# Altium project Rear_Controller.PrjPcb (part 2 of 2)
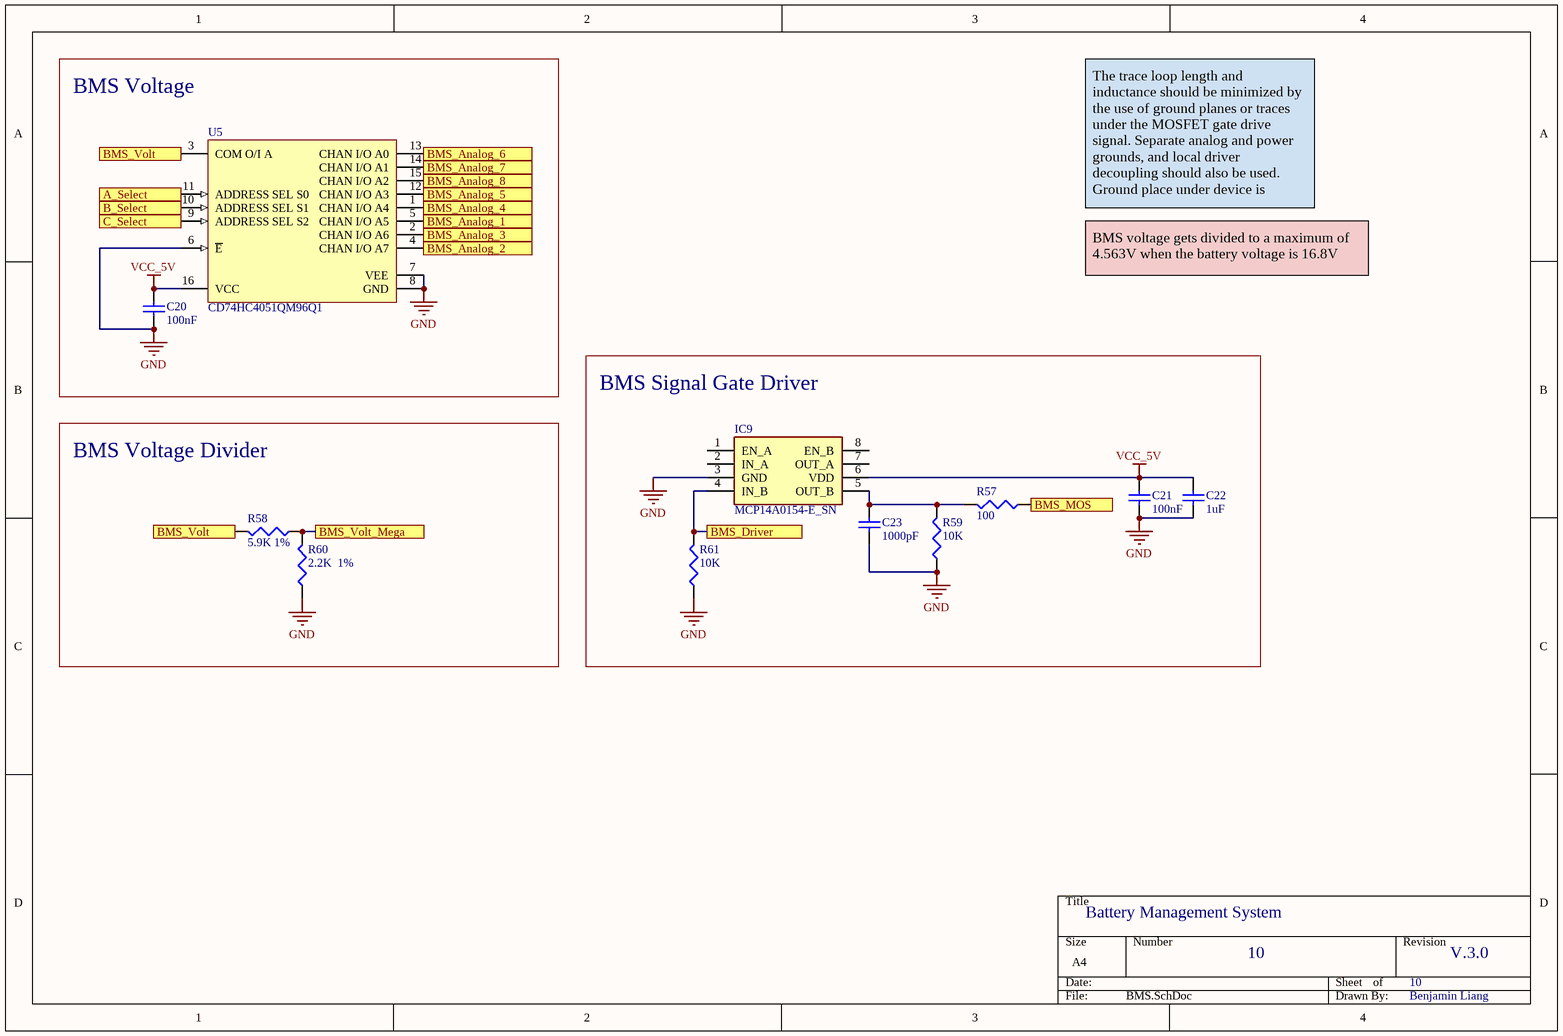
[diagram p11: BMS.SchDoc]

## Nets that join several sheets
Board_GND: Arduino_Shields (U1.31), Passive_Circuits (8 pins), Frequency_Analog (24 pins), SPI_Breakout (5 pins), Connector (12 pins), PWM_Pump_Led (8 pins), Power_Relay (8 pins), Shutdown_Circuit (6 pins), Power_Distribution (R54.1)
GND: Arduino_Shields (A1.GND1 A1.GND2 A1.GND4 A1.GND5), Passive_Circuits (R27.2 R30.2), Connector (J1.5), Power_Relay (R38.2 R64.2), Power_Distribution (10 pins), BMS (11 pins)
INV_AGND: Arduino_Shields (U1.6), Passive_Circuits (C3.2 C4.2), SPI_Breakout (J5.10), Connector (X1.3 X1.6 X2.31)
VCC_3.3V: Arduino_Shields (A1.3V3 U1.19), Frequency_Analog (IC5.11 IC6.11 IC7.11 IC8.11), SPI_Breakout (J4.1 J7.1)
VCC_5V: Passive_Circuits (6 pins), Frequency_Analog (12 pins), SPI_Breakout (6 pins), Connector (10 pins), Shutdown_Circuit (6 pins), Power_Distribution (F8.3 F8.4 R53.2), BMS (5 pins)
VCC_8V: Arduino_Shields (A1.VIN U1.32), Power_Distribution (F9.3 F9.4)
VCC_12V: Power_Relay (13 pins), Power_Distribution (F5.3 F5.4)
A_Select: Arduino_Shields (A1.35), BMS (U5.11)
APPS_2_4.5V: Connector (X1.34), Power_Distribution (R53.1 R54.2)
APPS_In_1_Analog: Arduino_Shields (U1.21), Passive_Circuits (C4.1 R17.1)
APPS_In_1_Analog_H: Passive_Circuits (R17.2), Connector (X1.30)
APPS_In_2_Analog: Arduino_Shields (U1.22), Passive_Circuits (C3.1 R13.1)
APPS_In_2_Analog_H: Passive_Circuits (R13.2), Connector (X1.29)
APPS_Out_Analog: Arduino_Shields (U1.26), SPI_Breakout (J5.6), Connector (X2.27)
B_Select: Arduino_Shields (A1.34), BMS (U5.10)
BATT_14.8V: Connector (J2.1 J2.2 J2.3), Power_Distribution (13 pins)
BMS_Analog_1: Connector (P1.2), BMS (U5.5)
BMS_Analog_2: Connector (P1.3), BMS (U5.4)
BMS_Analog_3: Connector (P1.4), BMS (U5.2)
BMS_Analog_4: Connector (P1.5), BMS (U5.1)
BMS_Analog_5: Connector (P2.2), BMS (U5.12)
BMS_Analog_6: Connector (P2.3), BMS (U5.13)
BMS_Analog_7: Connector (P2.4), BMS (U5.14)
BMS_Analog_8: Connector (P2.5), BMS (U5.15)
BMS_Driver: Arduino_Shields (A1.7), BMS (IC9.4 R61.2)
BMS_MOS: Connector (J1.6), BMS (R57.1)
BMS_Temp_Analog_1: Arduino_Shields (A1.AD0), Passive_Circuits (R27.1), Connector (J1.3)
BMS_Temp_Analog_2: Arduino_Shields (A1.AD1), Passive_Circuits (R30.1), Connector (J1.4)
BMS_Volt_Mega: Arduino_Shields (A1.AD12), BMS (R58.1 R60.2)
Brake_Digital: Arduino_Shields (A1.29), Connector (X2.29)
Brake_In_Analog: Arduino_Shields (U1.23), Passive_Circuits (C5.1 R21.1)
Brake_In_Analog_H: Passive_Circuits (R21.2), Connector (X1.28)
C_Select: Arduino_Shields (A1.36), BMS (U5.9)
CAN_1_INT: Arduino_Shields (A1.3), SPI_Breakout (J3.17)
CAN_2_INT: Arduino_Shields (A1.2), SPI_Breakout (J6.17)
CAN_3_INT: Arduino_Shields (U1.7), SPI_Breakout (J8.17)
CANH: SPI_Breakout (J3.2 J8.2), Connector (X2.34 X3.32)
CANL: SPI_Breakout (J3.3 J8.3), Connector (X2.35 X3.33)
Cool_PSR_INV_IN_ANALOG: Arduino_Shields (A1.AD6), Connector (X2.19)
Cool_PSR_INV_OUT_ANALOG: Arduino_Shields (A1.AD7), Connector (X2.8)
Cool_PSR_MTR_IN_ANALOG: Arduino_Shields (A1.AD10), Connector (X2.21)
Cool_PSR_MTR_OUT_ANALOG: Arduino_Shields (A1.AD11), Connector (X2.10)
Cool_Temp_INV_IN_ANALOG: Arduino_Shields (A1.AD4), Passive_Circuits (R14.1), Connector (X2.18)
Cool_Temp_INV_OUT_ANALOG: Arduino_Shields (A1.AD5), Passive_Circuits (R18.1), Connector (X2.7)
Cool_Temp_MTR_IN_ANALOG: Arduino_Shields (A1.AD8), Passive_Circuits (R23.1), Connector (X2.20)
Cool_Temp_MTR_OUT_ANALOG: Arduino_Shields (A1.AD9), Passive_Circuits (R25.1), Connector (X2.9)
CS_ACCEL: Arduino_Shields (A1.49), SPI_Breakout (J4.13)
CS_APPS: Arduino_Shields (U1.12), SPI_Breakout (J5.13)
CS_CAN_1: Arduino_Shields (A1.47), SPI_Breakout (J3.13)
CS_CAN_2: Arduino_Shields (A1.48), SPI_Breakout (J6.13)
CS_CAN_3: Arduino_Shields (U1.14), SPI_Breakout (J8.13)
CS_GYRO: Arduino_Shields (A1.53), SPI_Breakout (J7.13)
DAQ_12V: Connector (8 pins), Power_Distribution (F7.3 F7.4)
DAQ_CANH: SPI_Breakout (J6.2), Connector (6 pins)
DAQ_CANL: SPI_Breakout (J6.3), Connector (6 pins)
Dash_Switch_1_Digital: Arduino_Shields (A1.23), Passive_Circuits (R20.1), Connector (X3.17)
Dash_Switch_2_Digital: Arduino_Shields (A1.22), Passive_Circuits (R15.1), Connector (X3.28)
FAN_L_14.8V: Power_Relay (K3.1), Power_Distribution (F4.3 F4.4)
FAN_L_14.8V_H: Connector (X3.10), Power_Relay (K3.4)
FAN_L_Digital: Arduino_Shields (A1.31), Power_Relay (R34.1 R36.1)
FAN_R_14.8V: Power_Relay (K1.1), Power_Distribution (F3.3 F3.4)
FAN_R_14.8V_H: Connector (X1.35), Power_Relay (K1.4)
FAN_R_Digital: Arduino_Shields (A1.33), Power_Relay (R31.1 R32.1)
FIFO: Arduino_Shields (A1.12), SPI_Breakout (J7.5)
Flow_INV_FREQ: Frequency_Analog (IC8.1), Connector (X2.5)
Flow_MTR_FREQ: Frequency_Analog (IC7.1), Connector (X2.6)
Flow_Rate_INV_ANALOG: Arduino_Shields (A1.AD2), Frequency_Analog (IC8.5 IC8.10 R52.2)
Flow_Rate_MTR_ANALOG: Arduino_Shields (A1.AD3), Frequency_Analog (IC7.5 IC7.10 R51.2)
Forward_Enable_Digital: Arduino_Shields (A1.28), Connector (X2.30)
HV_Box_14.8V: Connector (X2.2 X2.28 X3.21 X3.31), Shutdown_Circuit (IC3.1 IC3.2), Power_Distribution (F1.3 F1.4)
Ignition_Digital: Arduino_Shields (A1.38), Power_Relay (R33.1 R35.1)
Ignition_LED_Digital: Arduino_Shields (A1.46), Power_Relay (R37.2 R38.1)
Ignition_Signal: Connector (X2.4), Power_Relay (D4.2 K2.4)
Ignition_Switch_INT: Arduino_Shields (A1.SCL), Passive_Circuits (R22.1), Connector (X3.9)
INT: Arduino_Shields (A1.11), SPI_Breakout (J7.6)
INV_12V_H: Connector (X2.3), Power_Relay (D4.1 K4.4 R37.1)
INV_Fault_INT: Arduino_Shields (A1.18), Passive_Circuits (R16.2), Connector (X2.12)
INV_OK_Analog: Arduino_Shields (A1.AD14), Power_Relay (R26.2 R64.1)
INV_Pump_14.8V: Connector (X3.12), Power_Relay (K5.3)
INV_Pump_PWM: Arduino_Shields (A1.9), PWM_Pump_Led (R4.1 R6.1)
INV_Pump_Signal: Connector (X3.23), PWM_Pump_Led (Q2.3 R2.2)
Inv_Relay_Driver: Connector (X2.16), Power_Relay (D5.2 D7.2 K4.5 R26.1)
LDAC: Arduino_Shields (U1.13), SPI_Breakout (J5.19)
LED_1_Return: Connector (X3.19), PWM_Pump_Led (R7.2)
LED_2_Return: Connector (X3.14), PWM_Pump_Led (IC1.2)
LED_3_Return: Connector (X3.20), PWM_Pump_Led (IC1.3)
LED_Digital: Arduino_Shields (A1.44), PWM_Pump_Led (R11.1)
Light_12V: Connector (X1.19 X3.3), PWM_Pump_Led (R1.1 R2.1 R9.1 R10.1), Power_Distribution (F6.3 F6.4)
Mega_RX: Arduino_Shields (A1.0), Connector (X1.5)
Mega_TX: Arduino_Shields (A1.1), Connector (X1.4)
Micro_Reset: Arduino_Shields (U1.30), SPI_Breakout (J8.12)
MISO_Mega: Arduino_Shields (A1.50), SPI_Breakout (J3.14 J4.14 J6.14 J7.14)
MISO_Micro: Arduino_Shields (U1.33), SPI_Breakout (J5.14 J8.14)
MOSI_Mega: Arduino_Shields (A1.51), SPI_Breakout (J3.15 J4.15 J6.15 J7.15)
MOSI_Micro: Arduino_Shields (U1.1), SPI_Breakout (J5.15 J8.15)
MTR_Pump_14.8V: Connector (X1.12), Power_Relay (K5.4)
MTR_Pump_PWM: Arduino_Shields (A1.8), PWM_Pump_Led (R3.1 R5.1)
MTR_Pump_Signal: Connector (X1.2), PWM_Pump_Led (Q1.3 R1.2)
OE: Arduino_Shields (A1.32), SPI_Breakout (J4.19 J7.19)
Pre_Charge_Digital: Arduino_Shields (A1.5), Passive_Circuits (R62.1 R63.2)
Pre_Charge_Relay: Passive_Circuits (R62.2), Connector (X2.11)
Pump_14.8V: Power_Relay (K5.1), Power_Distribution (F2.3 F2.4)
Pump_Digital: Arduino_Shields (A1.30), Power_Relay (R40.1 R41.1)
Ready_To_Drive_IN: Arduino_Shields (A1.25), Passive_Circuits (R24.2), Connector (X3.7)
Ready_To_Drive_OUT: Arduino_Shields (A1.24), Connector (X3.18)
Reset: Arduino_Shields (A1.RESET), SPI_Breakout (J3.12 J6.12)
RGB_B_Return: Connector (X3.6), PWM_Pump_Led (IC2.3)
RGB_Digital: Arduino_Shields (A1.45), PWM_Pump_Led (R12.1)
RGB_G_Return: Connector (X3.5), PWM_Pump_Led (IC2.2)
RGB_R_Return: Connector (X3.8), PWM_Pump_Led (R8.2)
RX0: Arduino_Shields (A1.6), SPI_Breakout (J3.6)
RX1: Arduino_Shields (A1.4), SPI_Breakout (J3.5)
RX2: Arduino_Shields (A1.13), SPI_Breakout (J6.6)
RX3: Arduino_Shields (A1.10), SPI_Breakout (J6.5)
RX_Micro: Arduino_Shields (U1.4), Connector (X1.9)
SCK_Mega: Arduino_Shields (A1.52), SPI_Breakout (J3.16 J4.16 J6.16 J7.16)
SCK_Micro: Arduino_Shields (U1.34), SPI_Breakout (J5.16 J8.16)
SDC_14.8V_H: Connector (J1.8), Shutdown_Circuit (IC3.3 IC3.4)
SDC_AMP: Arduino_Shields (A1.AD13), Passive_Circuits (R19.1), Shutdown_Circuit (IC3.7 IC4.2)
SDC_Fault_INT: Arduino_Shields (A1.19), Shutdown_Circuit (IC4.1 R42.2)
Spare_Analog: Arduino_Shields (A1.AD15), Connector (X1.20)
Spare_Pin_2_Digital: Arduino_Shields (A1.37), Connector (X1.8)
Spare_Pin_3_Digital: Arduino_Shields (A1.27), Connector (X3.13)
Speed_FL_Analog: Arduino_Shields (U1.24), Frequency_Analog (IC6.5 IC6.10 R48.2)
Speed_FL_Digital: Arduino_Shields (U1.16), Passive_Circuits (R29.1), Frequency_Analog (IC6.1), Connector (X3.30)
Speed_RL_Analog: Arduino_Shields (U1.25), Frequency_Analog (IC5.5 IC5.10 R47.2)
Speed_RL_Digital: Arduino_Shields (U1.17), Passive_Circuits (R28.1), Frequency_Analog (IC5.1), Connector (X3.24)
Start_Output_Digital: Arduino_Shields (A1.26), Connector (X2.33)
TX_Micro: Arduino_Shields (U1.3), Connector (X1.10)